# Altium schematic sheet Charger_Input.SchDoc: =SheetTitle
size A4; SheetTitle: Charger Input; DrawnBy: Samyar Sadat Akhavi; DocumentNumber: 3; SheetNumber: 3; SheetTotal: 19
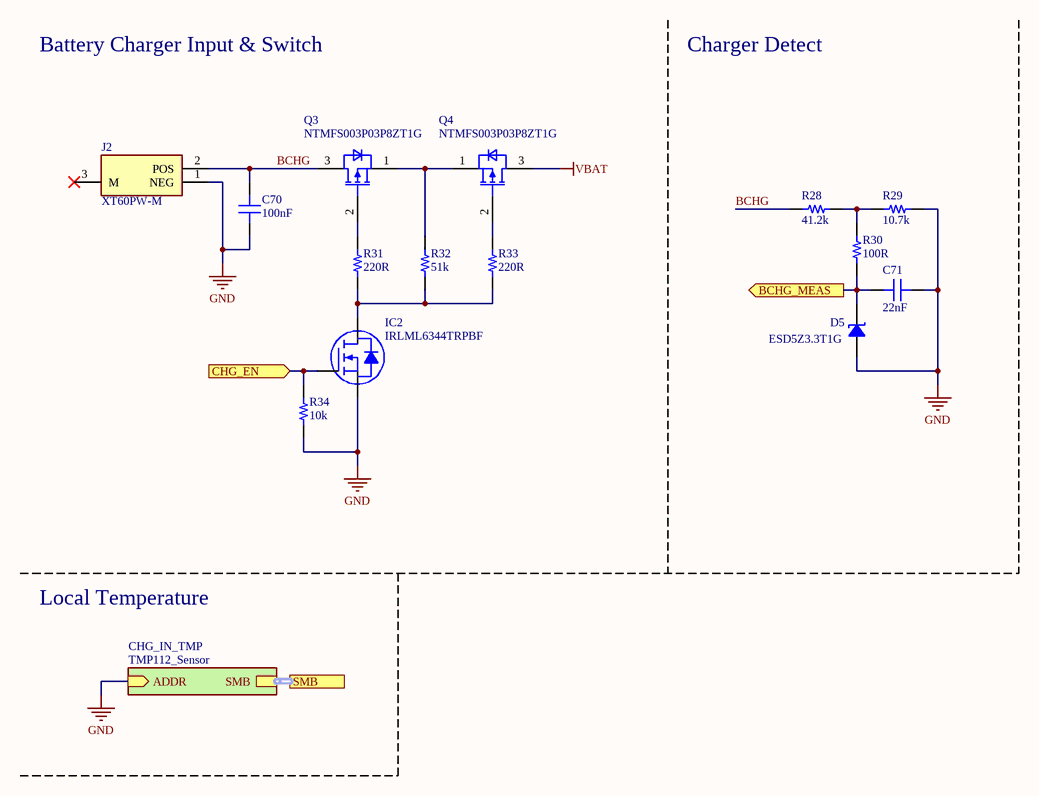
[diagram p0: Charger_Input.SchDoc]

## Parts
?  (no value)  (graphical)
C70  100nF  [CAP 0603_1608]
C71  22nF  [CAP 0603_1608]
D5  ESD5Z3.3T1G  [SOD523F]
IC2  IRLML6344TRPBF  [INFINEON SOT-23-3]
J2  XT60PW-M  [XT60PWM]
Q3  NTMFS003P03P8ZT1G  [NVMFS4C05NWFET1G]
Q4  NTMFS003P03P8ZT1G  [NVMFS4C05NWFET1G]
R28  41.2k  [RES 0603_1608]
R29  10.7k  [RES 0603_1608]
R30  100R  [RES 0603_1608]
R31  220R  [RES 0603_1608]
R32  51k  [RES 0603_1608]
R33  220R  [RES 0603_1608]
R34  10k  [RES 0603_1608]

## Sub-sheets
CHG_IN_TMP = TMP112_Sensor: ADDR (in), SMB (harness SMBus)

## Ports
BCHG_MEAS (out, see Power_Board[2B], Microcontroller[3C]), CHG_EN (in, see Power_Board[2B], Microcontroller[3A]), SMB (harness SMBus, see Power_Board[1B], Battery_Input[4A], INA236_Sensor[3B], TMP112_Sensor[3B], VBAT_Output[3B])

## Nets
GND: C70.2 C71.2 D5.1 IC2.2(S) J2.1(NEG) R29.2 R34.1 ; sheet CHG_IN_TMP/ADDR
VBAT: Q4.3(D)
BCHG: C70.1 J2.2(POS) Q3.3(D) R28.1
BCHG_MEAS: C71.1 D5.2 R30.2 ; port BCHG_MEAS
CHG_EN: IC2.1(G) R34.2 ; port CHG_EN
NetIC2_3: IC2.3(D) R31.1 R32.1 R33.1
NetQ3_1: Q3.1(S) Q4.1(S) R32.2
NetQ3_2: Q3.2(G) R31.2
NetQ4_2: Q4.2(G) R33.2
NetR28_2: R28.2 R29.1 R30.1

Not connected (* = marked no-connect by the designer): J2 3(M)*

## Buses and harness runs
harness port SMB = sheet CHG_IN_TMP/SMB

## Notes on the sheet
- Battery Charger Input & Switch
- Charger Detect
- Local Temperature
- Sub-Project:
- Size:
- Drawn By:
- Revision:
- Date:
- File:
- Sheet:
- of

## Library data of the parts
? = SGR-STDTBSA4: STANDARD SCHEMATICS TITLE BLOCK
C70 = GEN-CC100NT10V50KX7R603: GENERIC 0603 MLC CAPACITOR; Tolerance: ±10%; Voltage: 50V; Dielectric: X7R; Part Number: GEN-CC100NT10V50KX7R603; Value: 100nF
C71 = GEN-CC22NT20V25KX7R603: GENERIC 0603 MLC CAPACITOR; Tolerance: ±20%; Voltage: 25V; Dielectric: X7R; Part Number: GEN-CC22NT20V25KX7R603; Value: 22nF
D5 = ESD5Z3.3T1G: TVS DIODE 3.3V 14.1V SOD523; Manufacturer: ON Semiconductor; Capacitance @ Frequency: 105pF @ 1MHz; Current - Peak Pulse (10/1000µs): 11.2A (8/20µs); Power Line Protection: No; Power - Peak Pulse: 158W; Type: Zener; Unidirectional Channels: 1; Voltage - Breakdown (Min): 5V; Voltage - Reverse Standoff (Typ): 3.3V (Max); Part Number: ESD5Z3.3T1G; Applications: General Purpose; ComponentLink1Description: Datasheet; ComponentLink1URL: https://www.onsemi.com/pub/Collateral/ESD5Z2.5T1-D.PDF; ComponentLink2Description: DigiKey Link; ComponentLink2URL: http://digikey.com/product-detail/en/on-semiconductor/ESD5Z3.3T1G/ESD5Z3.3T1GOSCT-ND/1967044; LastUpdated: 4/5/2026 9:01:13 PM; Lifecycle Status: Active; Minimum Order: 1; Mounting Type: Surface Mount; Operating Temperature: -55°C ~ 150°C (TJ); Package / Case: SC-79, SOD-523; Packaging: TapeAndReel; PartId: 9754; Part Status: Active; Price: 0.04; Series: -; Supplier 1: DigiKey; Supplier Part Number 1: ESD5Z3.3T1GOSCT-ND; Supplier Device Package: SOD-523; Voltage - Clamping (Max) @ Ipp: 14.1V
IC2 = IRLML6344TRPBF: MOSFET N-CH 30V 5A MICRO3/SOT23; Manufacturer: Infineon Technologies; Current - Continuous Drain (Id) @ 25°C: 5A (Ta); Drive Voltage (Max Rds On,  Min Rds On): 2.5V, 4.5V; FET Type: N-Channel; Gate Charge (Qg) (Max) @ Vgs: 6.8 nC @ 4.5 V; Input Capacitance (Ciss) (Max) @ Vds: 650 pF @ 25 V; Power Dissipation (Max): 1.3W (Ta); Rds On (Max) @ Id, Vgs: 29mOhm @ 5A, 4.5V; Vgs (Max): ±12V; Vgs(th) (Max) @ Id: 1.1V @ 10µA; Part Number: IRLML6344TRPBF; ComponentLink1Description: Datasheet; ComponentLink1URL: https://www.infineon.com/dgdl/irlml6344pbf.pdf?fileId=5546d462533600a4015356689c44262c; ComponentLink2Description: DigiKey Link; ComponentLink2URL: https://www.digikey.com/en/products/detail/infineon-technologies/IRLML6344TRPBF/2538152; Drain to Source Voltage (Vdss): 30 V; LastUpdated: 4/5/2026 8:53:29 PM; Lifecycle Status: Active; Minimum Order: 1; Mounting Type: Surface Mount; Operating Temperature: -55°C ~ 150°C (TJ); Package / Case: TO-236-3, SC-59, SOT-23-3; Packaging: TapeAndReel; Part Status: Active; Price: 0.09; Series: HEXFET®; Supplier 1: DigiKey; Supplier Part Number 1: IRLML6344TRPBFCT-ND; Supplier Device Package: Micro3™/SOT-23; Technology: MOSFET (Metal Oxide)
J2 = XT60PW-M: MALE XT60 PCB-MOUNT SOLDERABLE CONNECTOR; Manufacturer: AMASS; Part Number: XT60PW-M; Supplier 1: TME; Supplier Part Number 1: XT60PW-M
Q3 Q4 = NTMFS003P03P8ZT1G: MOSFET, POWER -30V P-CHANNEL, SO; Manufacturer: onsemi; Part Number: NTMFS003P03P8ZT1G; Supplier 1: DigiKey; Supplier Part Number 1: 488-NTMFS003P03P8ZT1G-ND
R28 = GEN-CRR41K2T1P8603: GENERIC 0603 CHIP RESISTOR; Tolerance: ±1%; Power: 0.125W; Part Number: GEN-CRR41K2T1P8603; Value: 41.2k
R29 = GEN-CRR10K7T1P8603: GENERIC 0603 CHIP RESISTOR; Tolerance: ±1%; Power: 0.125W; Part Number: GEN-CRR10K7T1P8603; Value: 10.7k
R30 = GEN-CRR100T1P8603: GENERIC 0603 CHIP RESISTOR; Tolerance: ±1%; Power: 0.125W; Part Number: GEN-CRR100T1P8603; Value: 100R
R31 R33 = GEN-CRR220T5P8603: GENERIC 0603 CHIP RESISTOR; Tolerance: ±5%; Power: 0.125W; Part Number: GEN-CRR220T5P8603; Value: 220R
R32 = GEN-CRR51KT5P8603: GENERIC 0603 CHIP RESISTOR; Tolerance: ±5%; Power: 0.125W; Part Number: GEN-CRR51KT5P8603; Value: 51k
R34 = GEN-CRR10KT1P8603: GENERIC 0603 CHIP RESISTOR; Tolerance: ±1%; Power: 0.125W; Part Number: GEN-CRR10KT1P8603; Value: 10k